# EAGLE design implant9 (EAGLE 7.6.0)
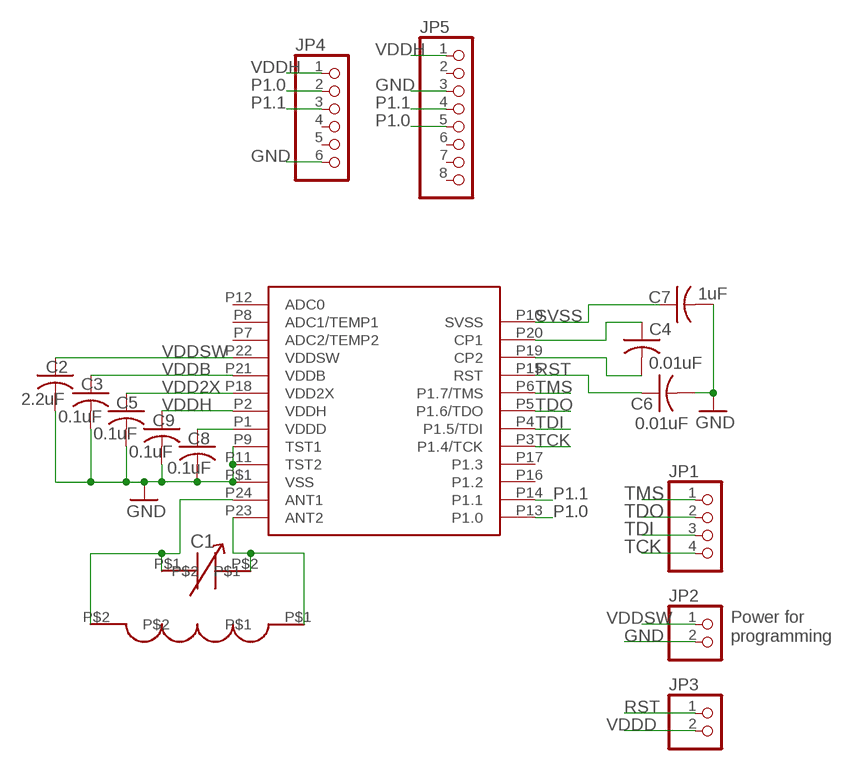
[diagram p0: schematic, sheet 1]

## Parts
C2  2.2uF  C-USC0805  [C0805]
C3  0.1uF  C-USC0805  [C0805]
C4  0.01uF  C-USC0805  [C0805]
C5  0.1uF  C-USC0805  [C0805]
C6  0.01uF  C-USC0805  [C0805]
C7  1uF  C-USC0805  [C0805]
C8  0.1uF  C-USC0805  [C0805]
C9  0.1uF  C-USC0805  [C0805]
JP1  PINHD-1X4  [1X04]
JP2  PINHD-1X2  [1X02]
JP3  PINHD-1X2  [1X02]
JP4  PINHD-1X6  [1X06]
JP5  PINHD-1X8  [1X08]
U$1  RF430FRL152H  [VQFN]
U$2  COILCOIL3  [COIL3]
U$3  VAR_CAP  [VAR_CAP]

## Nets
GND: C2.2 C3.2 C5.2 C6.2 C7.2 C8.2 C9.2 JP2.2 JP4.6 JP5.3 U$1.P9(TST1) U$1.P11(TST2) U$1.P$1(VSS)
N$7: U$1.P23(ANT2) U$2.P$1 U$3.P$2
N$8: C4.1 U$1.P20(CP1)
N$9: C4.2 U$1.P19(CP2)
N$11: U$1.P24(ANT1) U$2.P$2 U$3.P$1
P1.0: JP4.2 JP5.5 U$1.P13(P1.0)
P1.1: JP4.3 JP5.4 U$1.P14(P1.1)
RST: C6.1 JP3.1 U$1.P15(RST)
SVSS: C7.1 U$1.P10(SVSS)
TCK: JP1.4 U$1.P3(P1.4/TCK)
TDI: JP1.3 U$1.P4(P1.5/TDI)
TDO: JP1.2 U$1.P5(P1.6/TDO)
TMS: JP1.1 U$1.P6(P1.7/TMS)
VDD2X: C5.1 U$1.P18(VDD2X)
VDDB: C3.1 U$1.P21(VDDB)
VDDD: C8.1 JP3.2 U$1.P1(VDDD)
VDDH: C9.1 JP4.1 JP5.1 U$1.P2(VDDH)
VDDSW: C2.1 JP2.1 U$1.P22(VDDSW)
Unconnected: JP4.4 JP4.5 JP5.2 JP5.6 JP5.7 JP5.8 U$1.P7(ADC2/TEMP2) U$1.P8(ADC1/TEMP1) U$1.P12(ADC0) U$1.P16(P1.2) U$1.P17(P1.3)

## Notes on the sheet
- C1
- Power for 
  programming

## Library data of the parts
C2-C9 = rcl:C-US: CAPACITOR, American symbol
JP1 = pinhead:PINHD-1X4: PIN HEADER
JP2 JP3 = pinhead:PINHD-1X2: PIN HEADER
JP4 = pinhead:PINHD-1X6: PIN HEADER
JP5 = pinhead:PINHD-1X8: PIN HEADER
U$1 = RF430:RF430FRL152H
U$2 = RF430:COIL
U$3 = RF430:VAR_CAP

## Board
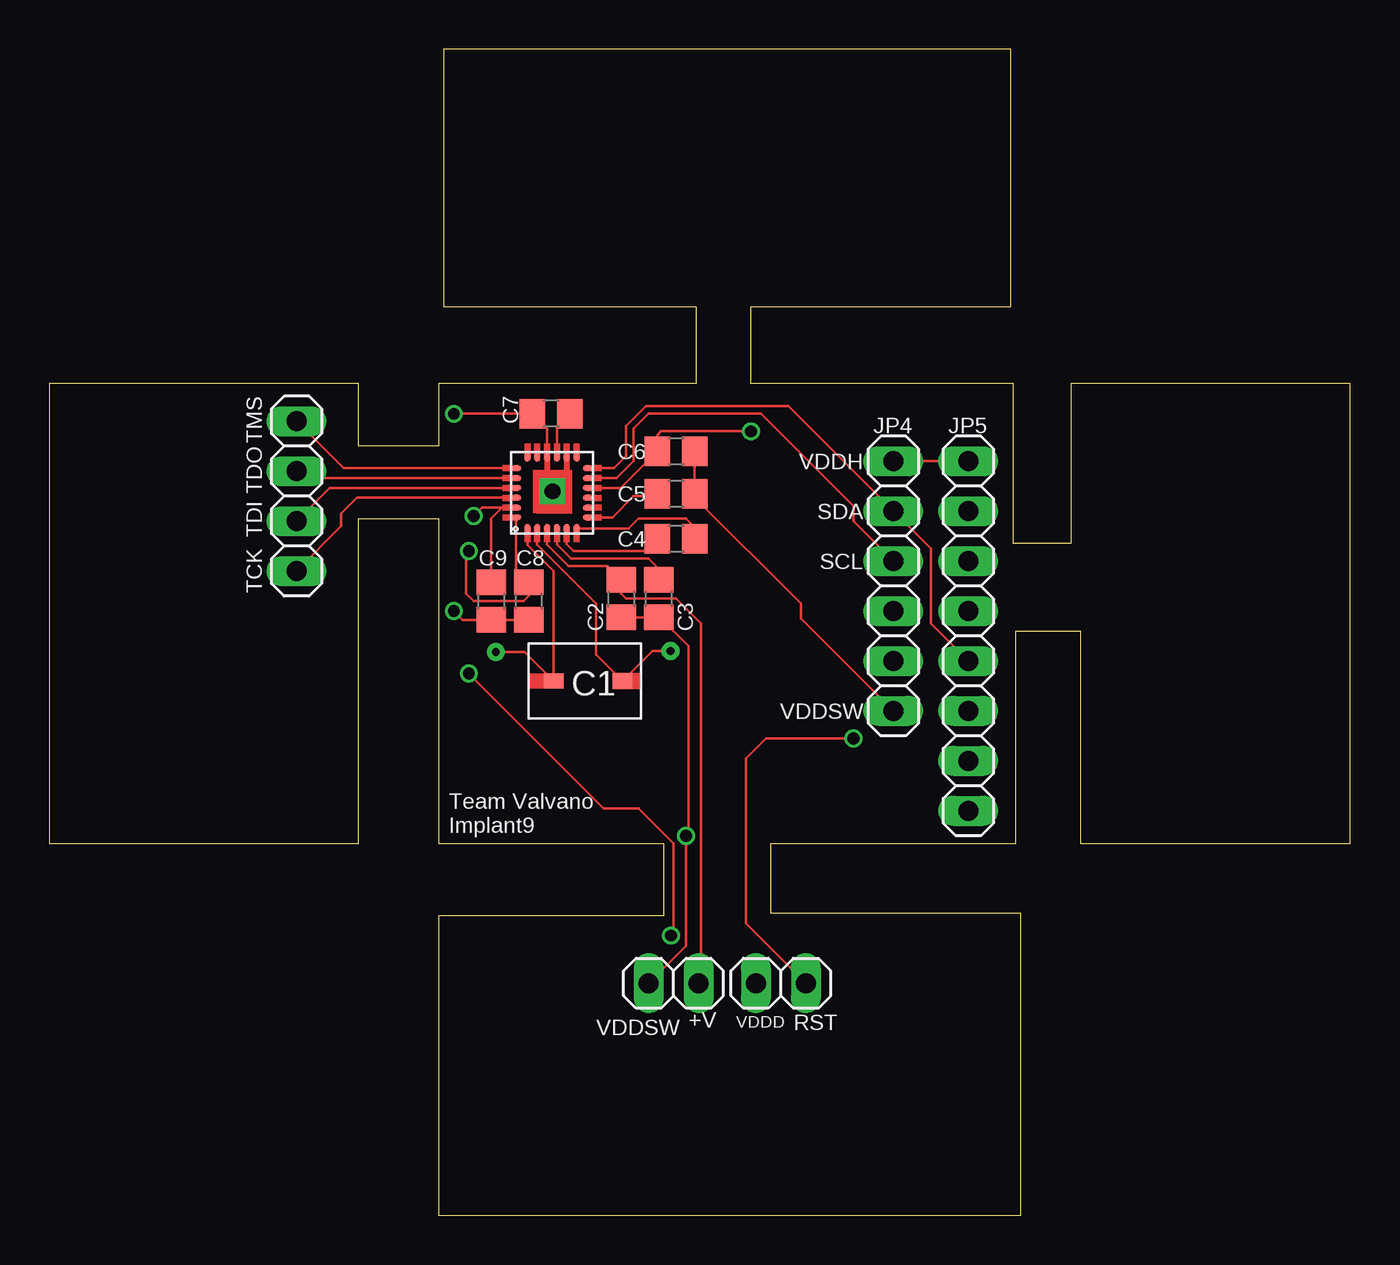
[diagram p1: board, top side]
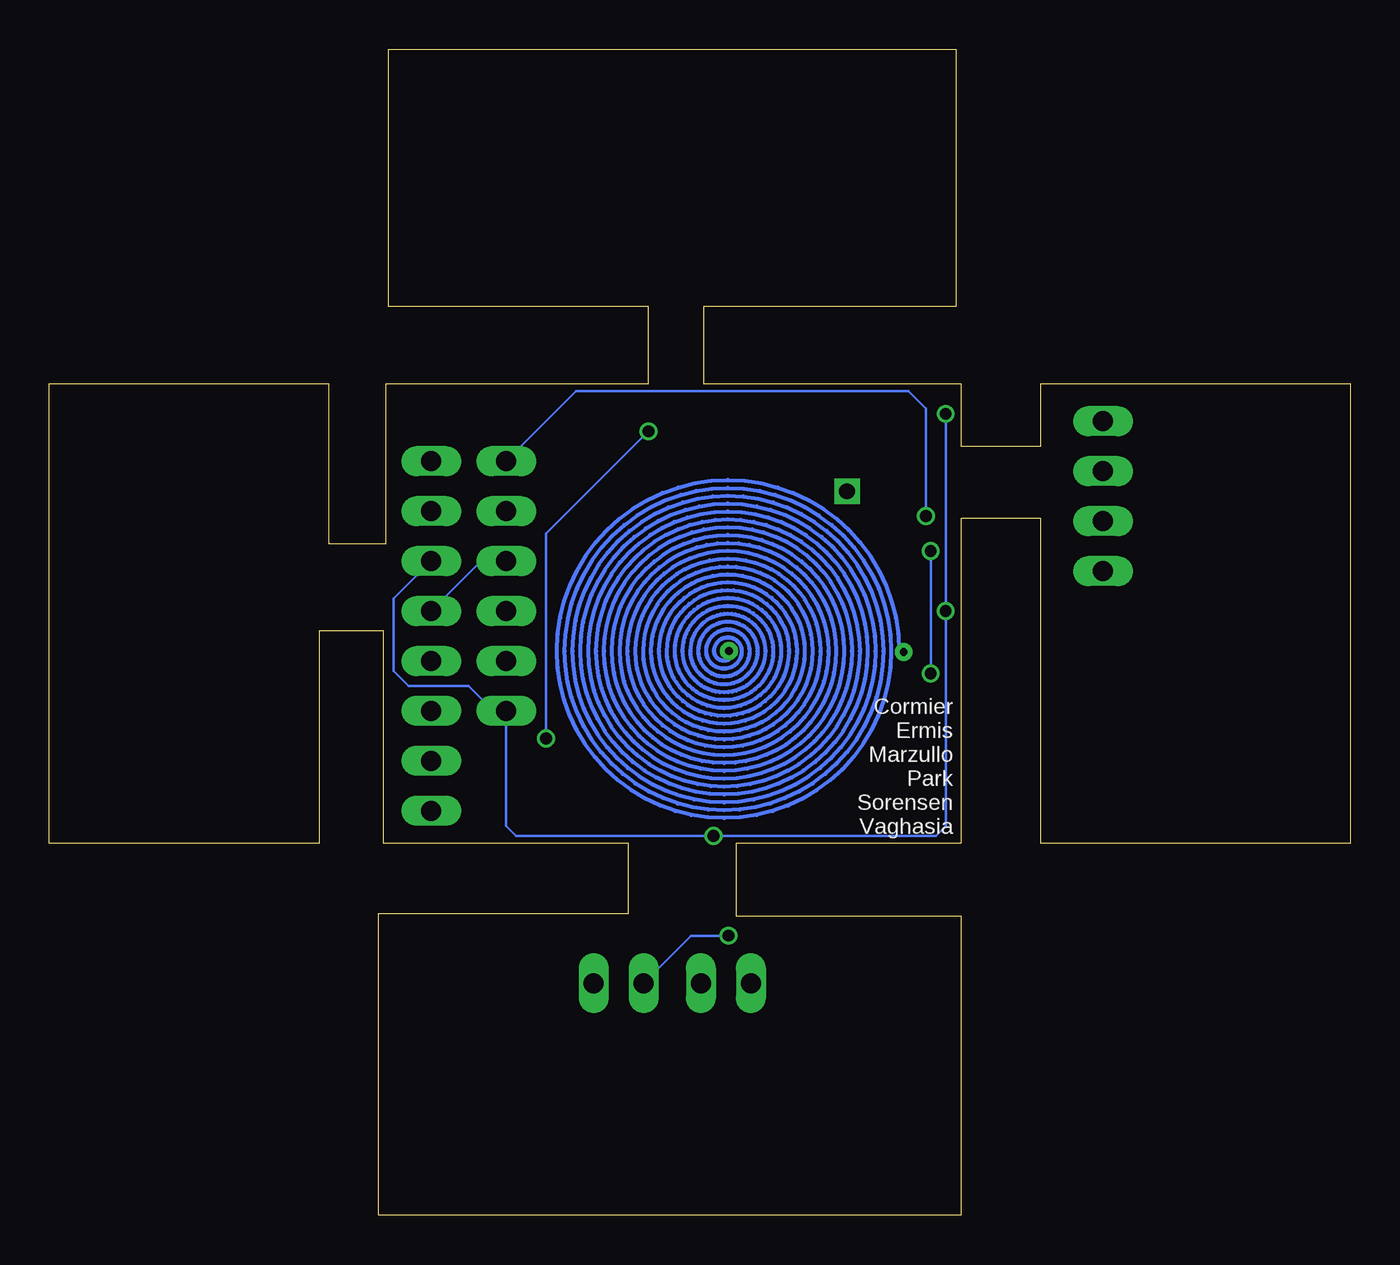
[diagram p2: board, bottom side, seen from below]

Size 66.17 x 59.31 mm. Coordinates in mm from the lower left corner, seen from the top.
Outline: 0,18.92 15.75,18.92 15.75,35.43 19.81,35.43 19.81,18.92 31.24,18.92 31.24,15.24 19.81,15.24 19.81,0 49.4,0 49.4,15.37 36.7,15.37 36.7,18.92 49.15,18.92 49.15,29.72 52.45,29.72 52.45,18.92 66.17,18.92 66.17,42.29 51.94,42.29 51.94,34.16 49.02,34.16 49.02,42.29 35.69,42.29 35.69,46.23 48.9,46.23 48.9,59.31 20.07,59.31 20.07,46.23 32.89,46.23 32.89,42.29 19.81,42.29 19.81,39.12 15.75,39.12 15.75,42.29 0,42.29 0,18.92
Copper layers (1*16): Top 0.035mm / dielectric 1.5mm / Bottom 0.035mm
Design rules "dirt_cheap_dirty_boards.v1": minimum track width 5mil, minimum drill 12mil, track to track 5mil, track to pad 5mil, pad to pad 5mil, via to via 5mil, smd to smd 0mil, copper to edge 10mil, drill to drill 10mil, minimum pad ring 10mil, minimum via ring 6mil, stop-mask expansion 2mil, vias tented up to drill 25mil, thermal gap 10mil

### Footprints (pad centres in the part's own frame; a part is rotated, then mirrored left to right if it is on the bottom)
C0805 = smd 1.3 x 1.5: 1 -0.95,0; 2 0.95,0
1X04 = drill 1.016 long: 1 -3.81,0; 2 -1.27,0; 3 1.27,0; 4 3.81,0
1X02 = drill 1.016 long: 1 -1.27,0; 2 1.27,0
1X06 = drill 1.016 long: 1 -6.35,0; 2 -3.81,0; 3 -1.27,0; 4 1.27,0; 5 3.81,0; 6 6.35,0
1X08 = drill 1.016 long: 1 -8.89,0; 2 -6.35,0; 3 -3.81,0; 4 -1.27,0; 5 1.27,0; 6 3.81,0; 7 6.35,0; 8 8.89,0
VQFN = smd 0.3 x 0.5: P1 0.825,-0.25; P2 1.325,-0.25; P3 1.825,-0.25; P4 2.325,-0.25; P5 2.825,-0.25; P6 3.325,-0.25; P13 3.325,-3.9; P14 2.825,-3.9; P15 2.325,-3.9; P16 1.825,-3.9; P17 1.325,-3.9; P18 0.825,-3.9; P26 0.825,-0.25; P34 2.824,-3.901; P35 2.324,-3.901; P36 3.324,-3.901; P37 1.824,-3.901; P38 1.324,-3.901; P39 0.824,-3.901; P40 3.324,-3.901 | smd 0.5 x 0.3: P7 3.9,-0.825; P8 3.9,-1.325; P9 3.9,-1.825; P10 3.9,-2.325; P11 3.9,-2.825; P12 3.9,-3.325; P19 0.25,-3.325; P20 0.25,-2.825; P21 0.25,-2.325; P22 0.25,-1.825; P23 0.25,-1.325; P24 0.25,-0.825; P27 3.906,-1.325; P28 3.906,-1.825; P29 3.906,-0.825; P30 3.906,-2.325; P31 3.906,-2.825; P32 3.906,-3.325; P33 3.906,-0.825; P41 0.25,-2.825; P42 0.25,-2.325; P43 0.25,-3.325; P44 0.25,-1.825; P46 0.25,-0.825; P47 0.25,-3.325 | drill 0.8 square: P$1 2.153,-2.097
COIL3 = drill 0.4 pad 0.6: P$1 0.151,-0.003; P$2 9.039,-0.051
VAR_CAP = smd 1 x 0.75: P$1 0,0 | smd 1 x 0.8: P$2 3.5,0

### Placement (x,y rotation side)
C2  29.08,31.37 270 top
C3  30.99,31.37 270 top
C4  31.88,34.42 0 top
C5  31.88,36.7 0 top
C6  31.88,38.86 0 top
C7  25.53,40.77 180 top
C8  24.38,31.24 270 top
C9  22.48,31.24 270 top
JP1  12.57,36.58 270 top
JP2  31.75,11.81 180 top
JP3  37.21,11.81 180 top
JP4  42.93,32 270 top
JP5  46.74,29.46 270 top
U$1  23.5,34.67 90 top
U$2  31.75,28.7 0 bottom
U$3  25.65,27.18 0 top

### Tracks (layer width: path | path; a pad name or v marks a point on that pad's centre or on a via)
GND  (via drill 0.6)
  Top 0.127: C2.2 C3.2 31.05,30.42 32.51,28.96 32.51,19.43 v32.39,19.3 32.39,13.72 JP2.2 | C8.2 C9.2 21.02,30.29 v20.57,30.73 | U$1.P9 25.32,40.02 C7.2 v20.57,40.77 | C6.2 C5.2 32.83,36.52 38.23,31.12 38.23,30.35 JP4.6
  Top 0.305: U$1.P9 25.32,37.1 U$1.P$1 26.32,37.55 U$1.P11
  Bottom 0.127: JP5.3 48.64,31.37 48.64,27.69 47.88,26.92 44.83,26.92 43.56,25.65 JP4.6 42.93,19.81 42.42,19.3 v32.39,19.3 21.08,19.3 20.57,19.81 v20.57,30.73 v20.57,40.77
N$7
  Top 0.127: U$2.P$1 30.68,28.7 U$3.P$2 27.81,28.52 27.81,31.12 24.82,34.11 U$1.P23
N$8
  Top 0.127: U$1.P20 26.32,34.13 26.67,33.78 30.29,33.78 C4.1
N$9
  Top 0.127: U$1.P19 29.46,34.92 29.97,35.43 32.39,35.43 32.77,35.05 32.77,34.48 C4.2
N$11
  Top 0.127: U$2.P$2 24.18,28.65 U$3.P$1 25.65,32.77 24.32,34.1 U$1.P24
P1.0
  Top 0.127: JP5.5 44.83,30.1 44.83,33.91 JP4.2 37.59,41.15 30.35,41.15 29.34,40.13 29.34,38.61 28.72,38 U$1.P13
P1.1
  Top 0.127: U$1.P14 28.86,37.5 29.72,38.35 29.72,40 30.48,40.77 36.2,40.77 40.89,36.07 40.89,35.31 JP4.3
  Bottom 0.127: JP4.3 44.2,33.27 JP5.4
RST  (via drill 0.6)
  Top 0.127: U$1.P15 29.06,37 C6.1 30.93,39.69 31.11,39.88 v35.69,39.88 | v40.89,24.26 36.45,24.26 35.43,23.24 35.43,14.86 JP3.1
  Bottom 0.127: v35.69,39.88 40.89,34.67 v40.89,24.26
SVSS
  Top 0.127: U$1.P10 25.82,40.11 C7.1
TCK
  Top 0.127: U$1.P3 15.67,36.5 14.86,35.69 14.86,35.05 JP1.4
TDI
  Top 0.127: U$1.P4 14.26,37 JP1.3
TDO
  Top 0.127: U$1.P5 12.92,37.5 JP1.2
TMS
  Top 0.127: U$1.P6 14.96,38 JP1.1
VDD2X
  Top 0.127: U$1.P18 28.64,35.5 29.72,36.58 30.8,36.58 C5.1
VDDB
  Top 0.127: U$1.P21 25.82,34.12 26.54,33.4 30.48,33.4 30.99,32.89 C3.1
VDDD  (via drill 0.6)
  Top 0.127: U$1.P1 23.75,32.83 C8.1 24.38,31.5 24.13,31.24 21.59,31.24 21.21,31.62 21.21,33.66 v21.34,33.78 | v21.34,27.56 28.19,20.7 29.97,20.7 31.75,18.92 31.75,14.35 v31.62,14.22
  Bottom 0.127: v21.34,33.78 v21.34,27.56 | v31.62,14.22 33.53,14.22 JP3.2
VDDH  (via drill 0.6)
  Top 0.127: JP4.1 JP5.1 | C9.1 22.48,35.43 23.04,36 U$1.P2 22.03,36 v21.59,35.56
  Bottom 0.127: v21.59,35.56 21.59,41.02 22.48,41.91 39.37,41.91 JP4.1
VDDSW
  Top 0.127: U$1.P22 25.32,34.12 26.42,33.02 28.38,33.02 C2.1 29.08,31.62 29.34,31.37 31.88,31.37 33.15,30.1 33.15,11.94 JP2.1
(copper drawn outside any net)
  shapes: Top area x2

### Text on the board
tPlace: TMS | TDO | TDI | TCK | C1 | Team Valvano / Implant9 | +V
tNames: VDDH | SDA | SCL | VDDSW | VDDSW | VDDD | RST
bNames: Cormier / Ermis / Marzullo / Park / Sorensen / Vaghasia